# Altium schematic sheet WL-AD9226.SchDoc
size 594 x 420 mm; Address1: Address1; Address2: Address2; Address3: Address3; Address4: Address4; DocumentNumber: Wolf-Lite; SheetNumber: 4; Scale: 1:1; DocumentType: Схема электрическая принципиальная; FirstReferrence: UA3REO/R7KBI
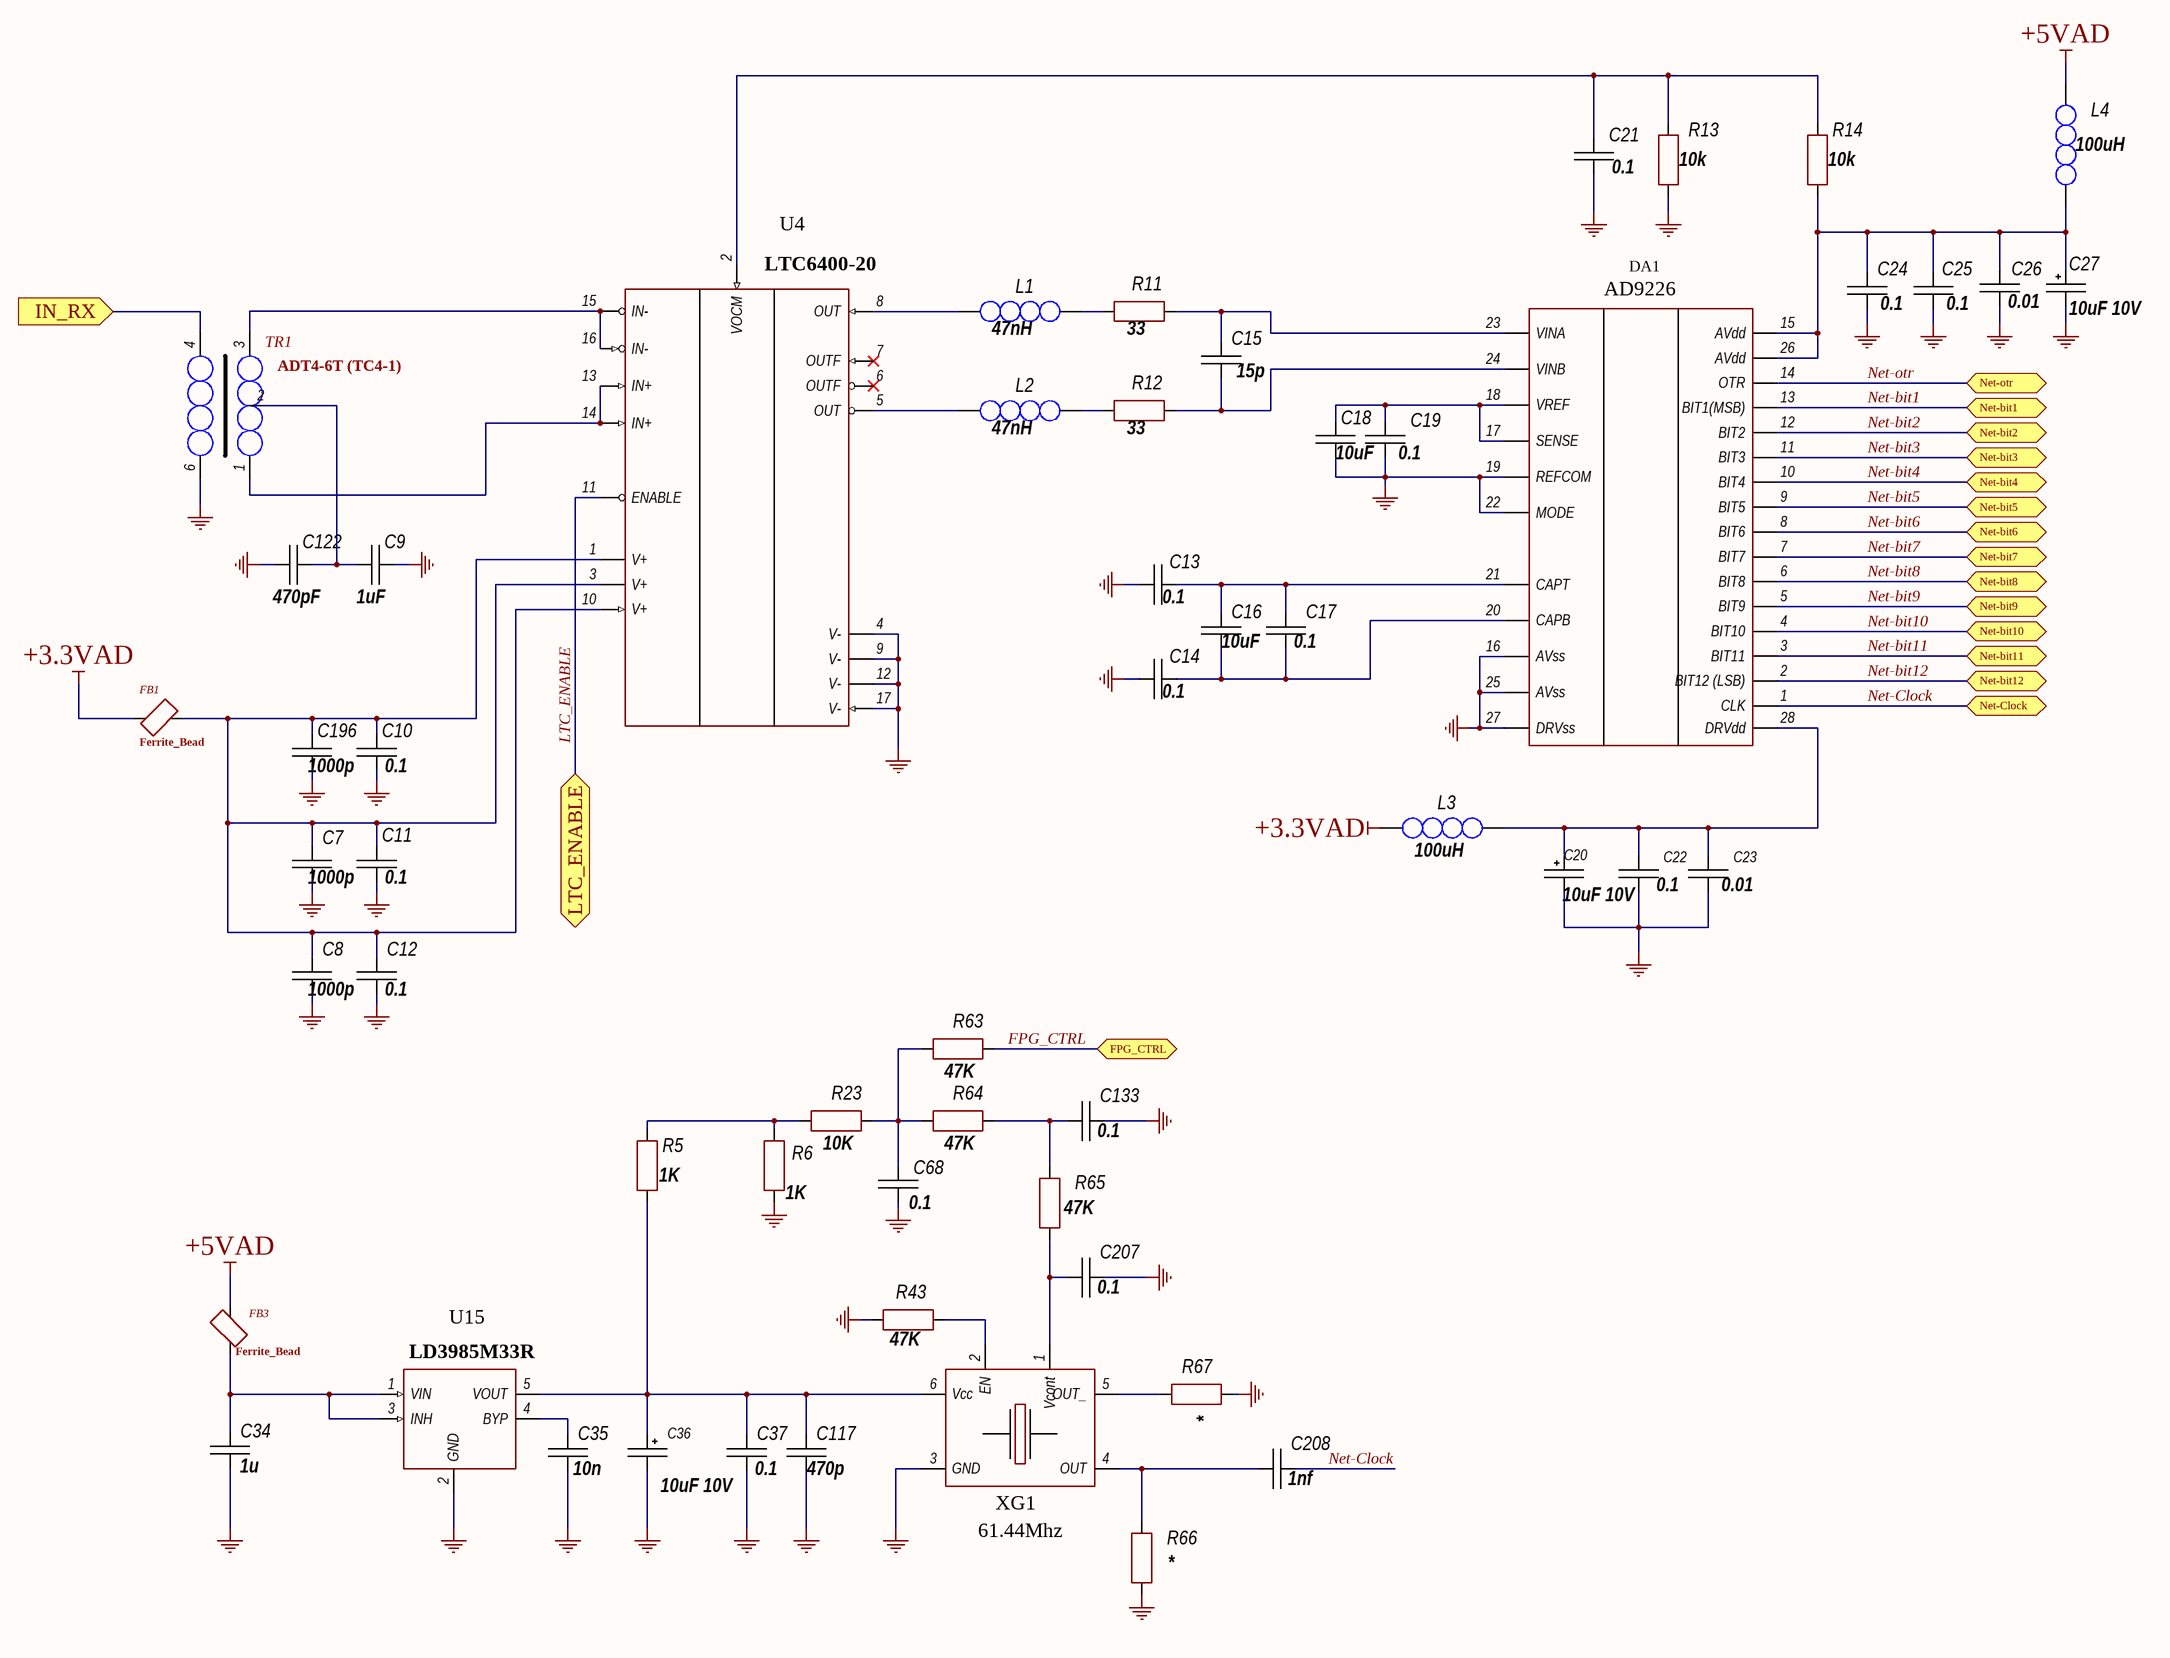
[diagram p0: WL-AD9226.SchDoc]

## Parts
C7  1000p  [CH0805C]
C8  1000p  [CH0805C]
C9  1uF  [CH0805C]
C10  0.1  [CH0805C]
C11  0.1  [CH0805C]
C12  0.1  [CH0805C]
C13  0.1  [CH0805C]
C14  0.1  [CH0805C]
C15  15p  [CH0805C]
C16  10uF  [CH0805C]
C17  0.1  [CH0805C]
C18  10uF  [CH0805C]
C19  0.1  [CH0805C]
C20  10uF 10V  [TANTAL_A]
C21  0.1  [CH0805C]
C22  0.1  [CH0805C]
C23  0.01  [CH0805C]
C24  0.1  [CH0805C]
C25  0.1  [CH0805C]
C26  0.01  [CH0805C]
C27  10uF 10V  [TANTAL_A]
C34  1u  [CH0805C]
C35  10n  [CH0805C]
C36  10uF 10V  [TANTAL_A]
C37  0.1  [CH0805C]
C68  0.1  [CH0805C]
C117  470p  [CH0805C]
C122  470pF  [CH0805C]
C133  0.1  [CH0805C]
C196  1000p  [CH0805C]
C207  0.1  [CH0805C]
C208  1nf  [CH0805C]
DA1  AD9226  [28-SSOP]
FB1  Ferrite_Bead  [CH0805L]
FB3  Ferrite_Bead  [CH0805L]
L1  47nH  [L1210]
L2  47nH  [L1210]
L3  100uH  [CH0805L]
L4  100uH  [CH0805L]
R5  1K  [CH0805R]
R6  1K  [CH0805R]
R11  33  [CH0805R]
R12  33  [CH0805R]
R13  10k  [CH0805R]
R14  10k  [CH0805R]
R23  10K  [CH0805R]
R43  47K  [CH0805R]
R63  47K  [CH0805R]
R64  47K  [CH0805R]
R65  47K  [CH0805R]
R66  *  [CH0805R]
R67  *  [CH0805R]
TR1  ADT4-6T (TC4-1)  [TC1-4]
U4  LTC6400-20  [16-QFN 3x3]
U15  LD3985M33R  [SOT23-5]
XG1  61.44Mhz  [OCS: GENA]

## Ports
FPG_CTRL (bidir), IN_RX (in), LTC_ENABLE (bidir), Net-bit1 (bidir), Net-bit2 (bidir), Net-bit3 (bidir), Net-bit4 (bidir), Net-bit5 (bidir), Net-bit6 (bidir), Net-bit7 (bidir), Net-bit8 (bidir), Net-bit9 (bidir), Net-bit10 (bidir), Net-bit11 (bidir), Net-bit12 (bidir), Net-Clock (bidir), Net-otr (bidir)

## Nets
+3.3VAD: FB1.1 L3.2
+5VAD: FB3.2 L4.2
GND: C7.1 C8.1 C9.1 C10.1 C11.1 C12.1 C13.1 C14.1 C18.2 C19.1 C20.2 C21.1 C22.1 C23.1 C24.1 C25.1 C26.1 C27.2 C34.2 C35.2 C36.2 C37.2 C68.1 C117.2 C122.2 C133.2 C196.1 C207.2 DA1.16(AVss) DA1.19(REFCOM) DA1.22(MODE) DA1.25(AVss) DA1.27(DRVss) R6.2 R13.2 R43.2 R66.1 R67.1 TR1.6 U4.4(V-) U4.9(V-) U4.12(V-) U4.17(V-) U15.2(GND) XG1.3(GND)
FPG_CTRL: R63.1 ; port FPG_CTRL
IN_RX: TR1.4 ; port IN_RX
LTC_ENABLE: U4.11(ENABLE) ; port LTC_ENABLE
Net-bit1: DA1.13(BIT1(MSB)) ; port Net-bit1
Net-bit2: DA1.12(BIT2) ; port Net-bit2
Net-bit3: DA1.11(BIT3) ; port Net-bit3
Net-bit4: DA1.10(BIT4) ; port Net-bit4
Net-bit5: DA1.9(BIT5) ; port Net-bit5
Net-bit6: DA1.8(BIT6) ; port Net-bit6
Net-bit7: DA1.7(BIT7) ; port Net-bit7
Net-bit8: DA1.6(BIT8) ; port Net-bit8
Net-bit9: DA1.5(BIT9) ; port Net-bit9
Net-bit10: DA1.4(BIT10) ; port Net-bit10
Net-bit11: DA1.3(BIT11) ; port Net-bit11
Net-bit12: DA1.2(BIT12_(LSB)) ; port Net-bit12
Net-Clock: C208.2 DA1.1(CLK) ; port Net-Clock
Net-otr: DA1.14(OTR) ; port Net-otr
NetC7_2: C7.2 C8.2 C10.2 C11.2 C12.2 C196.2 FB1.2 U4.1(V+) U4.3(V+) U4.10(V+)
NetC9_2: C9.2 C122.1 TR1.2
NetC13_2: C13.2 C16.1 C17.1 DA1.21(CAPT)
NetC14_2: C14.2 C16.2 C17.2 DA1.20(CAPB)
NetC15_1: C15.1 DA1.24(VINB) R12.2
NetC15_2: C15.2 DA1.23(VINA) R11.2
NetC18_1: C18.1 C19.2 DA1.17(SENSE) DA1.18(VREF)
NetC20_1: C20.1 C22.2 C23.2 DA1.28(DRVdd) L3.1
NetC21_2: C21.2 R13.1 R14.2 U4.2(VOCM)
NetC24_2: C24.2 C25.2 C26.2 C27.1 DA1.15(AVdd) DA1.26(AVdd) L4.1 R14.1
NetC34_1: C34.1 FB3.1 U15.1(VIN) U15.3(INH)
NetC35_1: C35.1 U15.4(BYP)
NetC36_1: C36.1 C37.1 C117.1 R5.1 U15.5(VOUT) XG1.6(Vcc)
NetC68_2: C68.2 R23.1 R63.2 R64.2
NetC133_1: C133.1 R64.1 R65.2
NetC207_1: C207.1 R65.1 XG1.1(Vcont)
NetC208_1: C208.1 R66.2 XG1.4(OUT)
NetL1_1: L1.1 R11.1
NetL1_2: L1.2 U4.8(OUT)
NetL2_1: L2.1 R12.1
NetL2_2: L2.2 U4.5(OUT)
NetR5_2: R5.2 R6.1 R23.2
NetR43_1: R43.1 XG1.2(EN)
NetR67_2: R67.2 XG1.5(OUT_)
NetTR1_1: TR1.1 U4.13(IN+) U4.14(IN+)
NetTR1_3: TR1.3 U4.15(IN-) U4.16(IN-)

Not connected (* = marked no-connect by the designer): U4 6(OUTF)* 7(OUTF)*

## Notes on the sheet
- Перв. примен.
- Справ. №
- Подп. и дата
- Инв. № дубл.
- Взам. инв. №
- Инв. № подл.
- Изм.
- Лист
- № докум.
- Подп.
- Дата
- 2.106-A2
- Копировал
- Формат А2

## Library data of the parts
C7-C19 C21-C26 C34 C35 C37 C68 C117 C122 C133 C196 C207 C208 = Capacitor: Manufacturer: *; Model: *; HelpURL: *; ComponentKind: *; Value: *
C20 C27 C36 = TantalCap: Manufacturer: *; Model: *; HelpURL: *; ComponentKind: *; Value: *
FB1 FB3 = FB
L1-L4 = Inductor: Manufacturer: *; Model: *; HelpURL: *; ComponentKind: *; Value: *
R5 R6 R11-R14 R23 R43 R63-R67 = Resistor: Manufacturer: *; Model: *; HelpURL: *; ComponentKind: *; Value: *
TR1 = TC4-1
U4 = LTC6400
U15 = LD3985M33R_SOT23
XG1 = Generator